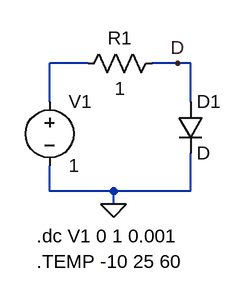
[diagram p0: schematic Fig_3-34_Diode_MyDiode-TEMP.asc]
Fig_3-34_Diode_MyDiode-TEMP.asc, the LTspice schematic file:
Version 4
SHEET 1 880 680
WIRE 144 96 96 96
WIRE 256 96 224 96
WIRE 272 96 256 96
WIRE 96 144 96 96
WIRE 272 144 272 96
WIRE 96 256 96 224
WIRE 176 256 96 256
WIRE 272 256 272 208
WIRE 272 256 176 256
WIRE 176 272 176 256
FLAG 176 272 0
FLAG 256 96 D
SYMBOL voltage 96 128 R0
WINDOW 123 0 0 Left 2
WINDOW 39 0 0 Left 2
SYMATTR InstName V1
SYMATTR Value 1
SYMBOL diode 256 144 R0
SYMATTR InstName D1
SYMBOL res 128 112 R270
WINDOW 0 32 56 VTop 2
WINDOW 3 0 56 VBottom 2
SYMATTR InstName R1
SYMATTR Value 1
TEXT 80 312 Left 2 !.dc V1 0 1 0.001
TEXT 80 344 Left 2 !.TEMP -10 25 60

The netlist it stands for:
* Fig_3-34_Diode_MyDiode-TEMP.asc
V1 N001 0 1
D1 D 0 D
R1 N001 D 1
.model D D
.lib standard.dio
.dc V1 0 1 0.001
.TEMP -10 25 60
.backanno
.end